# Altium schematic sheet isoCAN.SchDoc
size A4; CompanyName: Technische Hochschule Nürnberg Georg Simon Ohm; Organization: UltraZohm; Address1: Kesslerplatz 12; Address2: 90489 Nürnberg; Address3: GERMANY; SheetNumber: 16; SheetTotal: 36; Website: www.ultrazohm.com
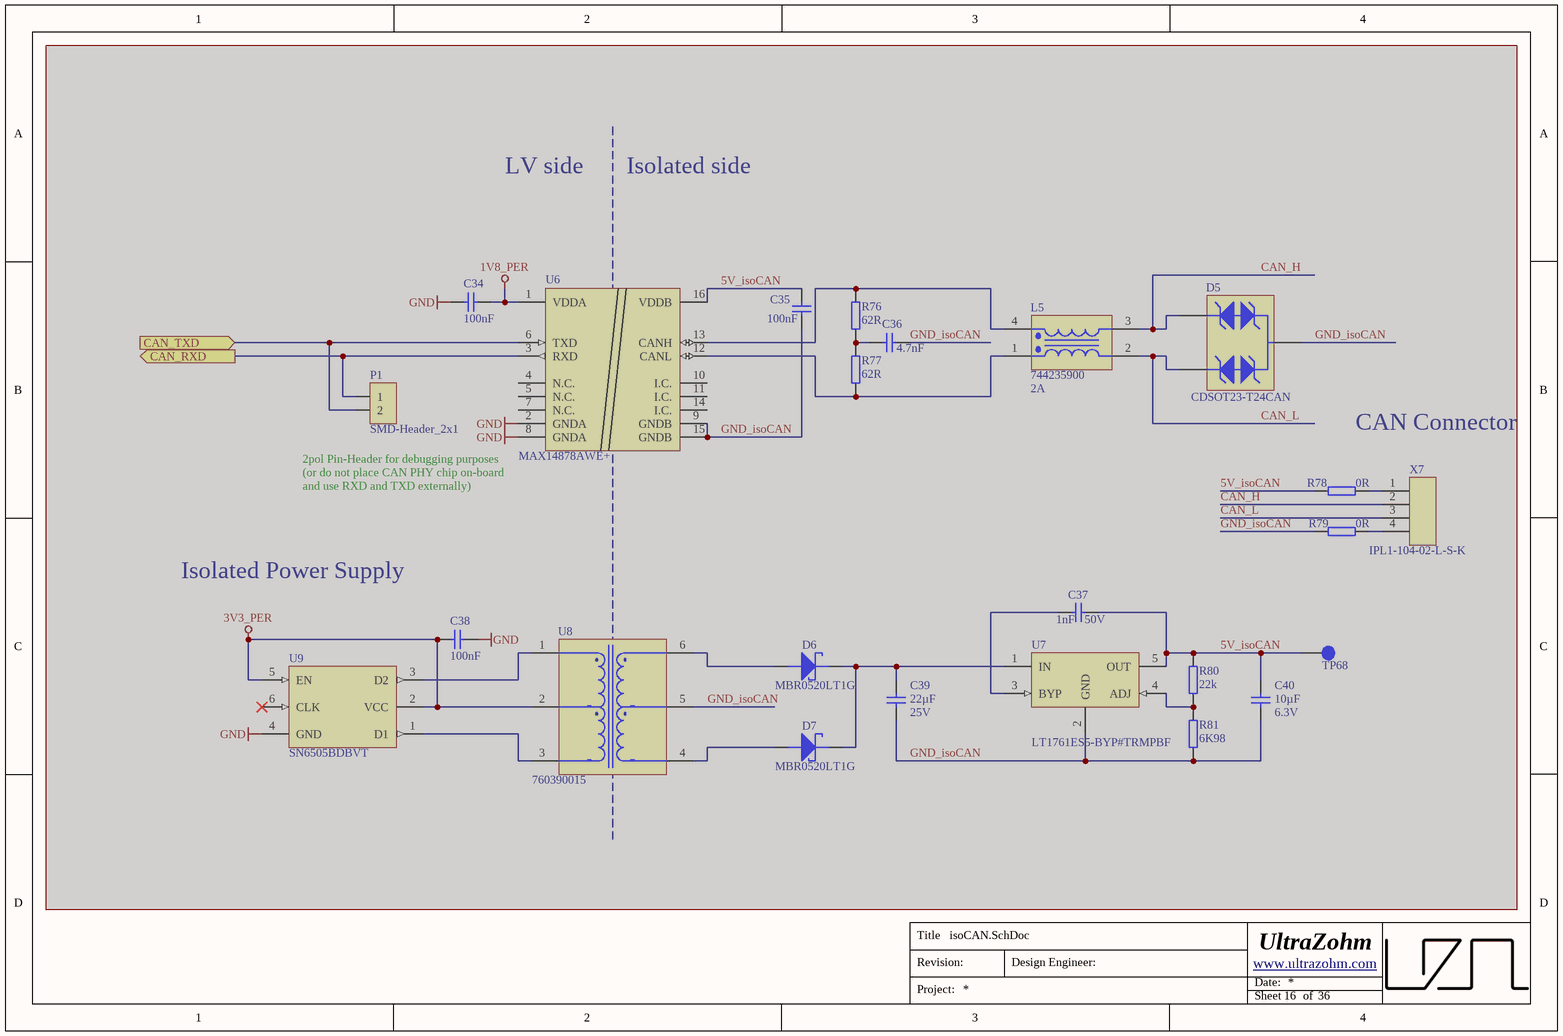
[diagram p0: isoCAN.SchDoc]

## Parts
C34  100nF  [CAPC1608X90N_V]  (masked out: inside a compile mask, not in the netlist)
C35  100nF  [CAPC1608X90N_V]  (masked out: inside a compile mask, not in the netlist)
C36  4.7nF  [CAPC1608X90N_V]  (masked out: inside a compile mask, not in the netlist)
C37  1nF  Voltage: 50V  [CAPC1608X90N_V]  (masked out: inside a compile mask, not in the netlist)
C38  100nF  [CAPC1608X90N_V]  (masked out: inside a compile mask, not in the netlist)
C39  22µF  Voltage: 25V  [CAPC2012X135N_V]  (masked out: inside a compile mask, not in the netlist)
C40  10µF  Voltage: 6.3V  [CAPC1608X90N_V]  (masked out: inside a compile mask, not in the netlist)
D5  CDSOT23-T24CAN  [SOT95P237X112-3N]  (masked out: inside a compile mask, not in the netlist)
D6  MBR0520LT1G  [SOD3816X120N]  (masked out: inside a compile mask, not in the netlist)
D7  MBR0520LT1G  [SOD3816X120N]  (masked out: inside a compile mask, not in the netlist)
L5  744235900  Voltage: 2A  [WE-CNSW-1812]  (masked out: inside a compile mask, not in the netlist)
P1  SMD-Header_2x1  [HDR1X2_SMD]  (masked out: inside a compile mask, not in the netlist)
R76  62R  [RESC1005X40N_V]  (masked out: inside a compile mask, not in the netlist)
R77  62R  [RESC1005X40N_V]  (masked out: inside a compile mask, not in the netlist)
R78  0R  [R_0603_TE]  (masked out: inside a compile mask, not in the netlist)
R79  0R  [R_0603_TE]  (masked out: inside a compile mask, not in the netlist)
R80  22k  [R_0603_TE]  (masked out: inside a compile mask, not in the netlist)
R81  6K98  [RESC1608X55N_V]  (masked out: inside a compile mask, not in the netlist)
TP68  Testpoint 1mm  [TP_1mm]  (value not drawn)  (masked out: inside a compile mask, not in the netlist)
U6  MAX14878AWE+  [SOIC127P1030X265-16N]  (masked out: inside a compile mask, not in the netlist)
U7  LT1761ES5-BYP#TRMPBF  [SOT23-5_N]  (masked out: inside a compile mask, not in the netlist)
U8  760390015  [760390015]  (masked out: inside a compile mask, not in the netlist)
U9  SN6505BDBVT  [SOT95P280X145-6N]  (masked out: inside a compile mask, not in the netlist)
X7  IPL1-104-02-L-S-K  [IPL1-104-02-L-S-K]  (masked out: inside a compile mask, not in the netlist)

## Ports
CAN_RXD (out), CAN_TXD (in)

## Notes on the sheet
- LV side
- Isolated side
- CAN Connector
- 2pol Pin-Header for debugging purposes
  (or do not place CAN PHY chip on-board and use RXD and TXD externally)
- Isolated Power Supply
- Title
- Revision:
- Design Engineer:
- Date:
- Project:
- Sheet
- of

## Library data of the parts
C34 C35 C38 = 21382: KON 100nF 50V X7R ±10% SMD BF 1608 (0603); Value: 100n; AN: 21382; Mixed: SMT; Preferred: Yes; Temperature-Range: -55/+125; Tolerance: ±10%; Voltage: 50V; Technology: X7R; Case: 1608 (0603)
C36 = 29638: KON 4.7nF 50V NP0 ±5%  SMD BF 1608 (0603); Value: 4.7n; AN: 29638; Mixed: SMT; Tolerance: ±5%; Voltage: 50V; Technology: NP0; Case: 1608 (0603)
C37 = 22523: KON 1nF 50V NP0 5% SMD BF 1608 (0603); Value: 1n; AN: 22523; Mixed: SMT; Technology: NP0; Case: 1608 (0603)
C39 = 29556: KON 22µF 25V  X5R 20% SMD BF 2012 (0805); Value: 22u; AN: 29556; Mixed: SMT; Temperature-Range: -55/+85; Technology: X5R; Case: 2012 (0805); Tolerance: 20%
C40 = 22918: KON 10µF 6,3V X5R SMD BF 1608 (0603); Value: 10u; AN: 22918; Mixed: SMT; Temperature-Range: -55/+85; Technology: X5R; Case: 1608 (0603)
D5 = 27400: TVS Diode 24/40V SOT23-3; AN: 27400; Mixed: SMT; Extra: ESD Protection of 2 lines, CAN bus, Bidirectional; Case: SOT23-3; HelpURL: b:\AD\adlib\datasheet\CDSOT23-T24CAN; H-ART: CDSOT23-T24CAN
D6 D7 = 26768: Schottky Diode 0.5A 20V SOD-123; AN: 26768; Mixed: SMT; Extra: AEC−Q101; Value: 20V; Case: SOD123-FC; Voltage: 0.5A; HelpURL: B:\AD\adlib\datasheet\MBR0520; H-ART: MBR0520LT1G
L5 = 30776: Common Mode Choke SMT 0.3uH 2A 50mOhms; AN: 30776; Tolerance: 20%; Value: 0.3u; Temperature-Range: -40/+85; Case: WE-CNSW-1812; Technology: 50mOhm; Mixed: SMT; HelpURL: b:\AD\adlib\datasheet\Wuerth\WE-CNSW\744235900\; H-ART: 744235900; Extra: 744235900
P1 = Pinheader_2x1_SMD: SMD-Header, 2-Pin; Created: 2018_12_05_AGeiger; Value: SMD-Header_2x1
R76 R77 = 23134: WID SMD 62R 1% 0,063W; Value: 62; AN: 23134; Mixed: SMT; Preferred: Yes; Extra: BF 1005 (0402); Tolerance: 1%; Case: 1005 (0402); Technology: TK100
R78 R79 = UZgen_R_0603_0R: Generic resistor; Manufacturer: UZgen; Tolerance: 1 %; Created from: UZgenTool; Value: 0R; Manufacturer Part Number: UZgen_R_0603_0R; PartID: 581; Created On: 08.07.2024 14:34:30; Device Package: 0603; Mounting Type: SMD; Last Updated: 08.07.2024 14:34:30
R80 = UZgen_R_0603_22k: Generic resistor; Manufacturer: UZgen; Tolerance: 1 %; Created from: UZgenTool; Value: 22k; Manufacturer Part Number: UZgen_R_0603_22k; PartID: 252; Created On: 02.07.2024 17:29:50; Device Package: 0603; Mounting Type: SMD; Last Updated: 02.07.2024 17:29:50
R81 = 26473: WID SMD 6K98 1% 0,1W  BF 1608 (0603); AN: 26473; Mixed: SMT; Value: 6.98k; Preferred: Yes; Tolerance: 1%; Case: 1608 (0603); Technology: TK100
TP68 = 25063: AN: 25063; Mixed: SMT
U6 = 30766: AN: 30766; Mixed: SMT; Trenz-Stock: Yes; Temperature-Range: -40/+125; Extra: 5kV Isolated CAN Transceiver SOIC-16; Case: SOIC16; HelpURL: b:\AD\adlib\datasheet\Maxim\MAX14878\; H-ART: MAX14878AWE+; Storage-Temperature: -60/+150(Abs)
U7 = LT1761ES5-BYP#TRMPBF: 100mA, Low Noise, LDO Micropower Regulators; belongs to SN74AVC4T774RSVR; Manufacturer: Linear Technology; Created from: MGremer; Manufacturer Part Number: LT1761ES5-BYP#TRMPBF; PartID: 5; Created On: 30.11.2020 13:55:34; ComponentLink1Description: Datasheet; ComponentLink1URL: https://www.analog.com/media/en/technical-documentation/data-sheets/1761sff.pdf; Component Type: LDO Micropower; Device Package: TSOT-23; Last Updated: 15.02.2021 10:27:30; Mounting Type: SMD; Supplier 1: Farnell; Supplier Part Number 1: 1663782; Type: LDO Micropower Regulator; Live Cycle Status: 1; Stock number: not stored
U8 = 30767: AN: 30767; Mixed: SMT; Temperature-Range: -40/+125; Extra: Push-Pull Transformer 1:2 0.35A; Case: MID-PPTI; HelpURL: b:\AD\adlib\datasheet\Wuerth\MID-PPTI\760390015\; H-ART: 760390015
U9 = 30768: AN: 30768; Mixed: SMT; Temperature-Range: -55/+125; Extra: 1-A Transformer Driver for Isolated Power Supplies SOT23-6; Case: SOT23-6; HelpURL: b:\AD\adlib\datasheet\TI\SN6505x\; H-ART: SN6505BDBVT; Storage-Temperature: -65/+150 (Abs)
X7 = 30790: AN: 30790; Mixed: SMT; H-ART: IPL1-104-02-L-S-K-TR; Temperature-Range: -55/+125; Extra: Connector Header IPL1, 1-row 4pos, key polarization, SMT 0°; Case: IPL1; HelpURL: b:\AD\adlib\datasheet\Samtec\IPL1-SMT\